# EAGLE design Adapter-IO4-Molex156 (EAGLE 7.7.0)
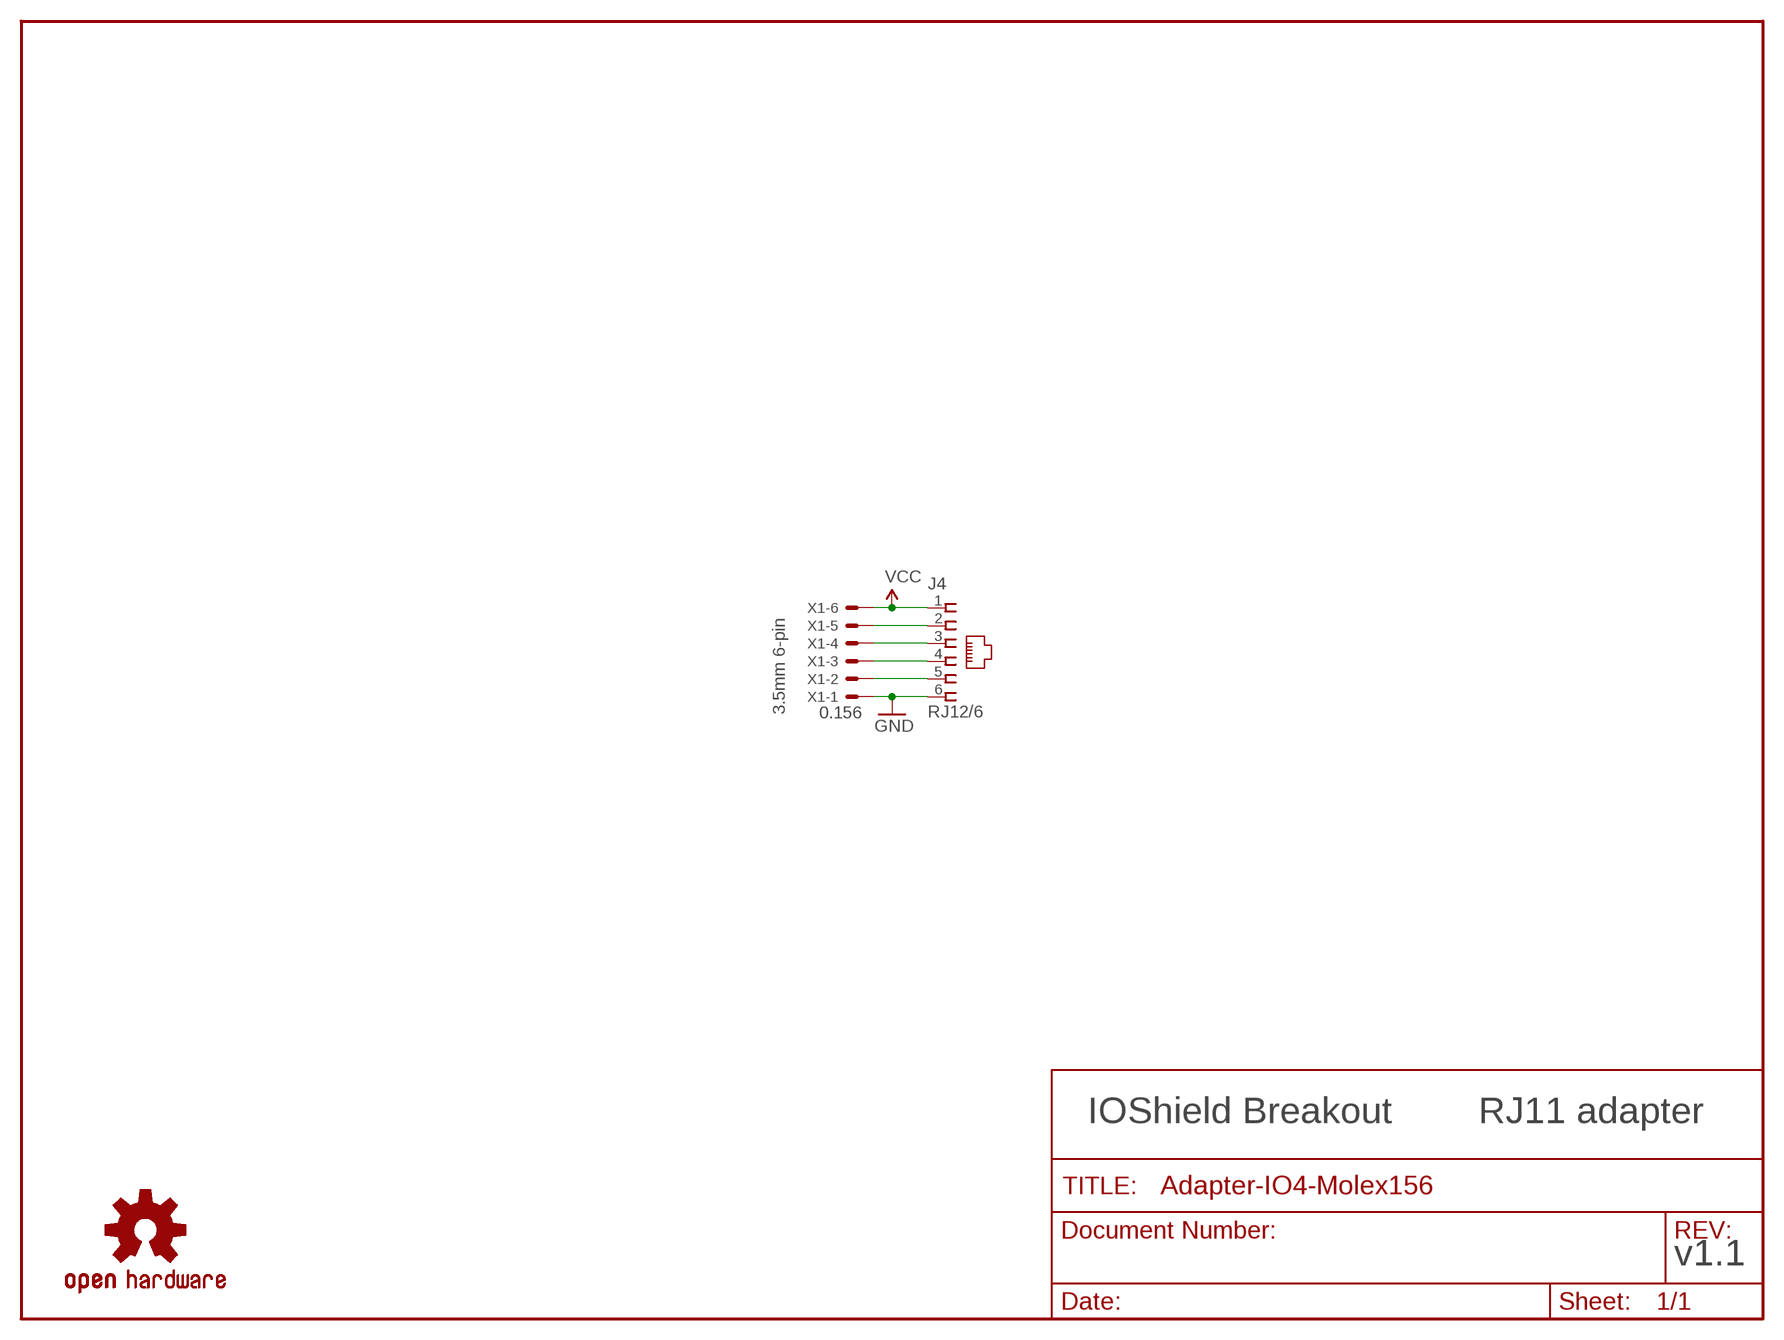
[diagram p0: schematic, sheet 1]

## Parts
J4  RJ12/6  CONNECTOR-RJ25-6P6C  [RJ25-PANEL]
U$1  OSHW  DOC-OSHW-LOGO-M  [OSHW-LOGO-M]
X1  0.156  KK-156-6  [KK-156-6]

## Nets
GND: J4.6 X1.1
IO1: J4.2 X1.5
IO2: J4.3 X1.4
IO3: J4.4 X1.3
IO4: J4.5 X1.2
VCC: J4.1 X1.6

## Notes on the sheet
- 3.5mm 6-pin
- IOShield Breakout | RJ11 adapter
- v1.1

## Library data of the parts
J4 = SPCoast:CONNECTOR-RJ25: AMP connector; AMP: 520250-3; OPL: none
U$1 = SPCoast:DOC-OSHW-LOGO-: Open Source Hardware Logo This logo indicates the piece of hardware it is found on incorporates a OSHW license and/or adheres to the definition of open source hardware http://freedomdefined.org/OSHW Creative Commons - Attribution - ShareAlike 3.0
X1 = SPCoast:KK-156-6: KK 156 HEADER Source: http://www.molex.com/pdm_docs/sd/026604100_sd.pdf; OC_FARNELL: unknown; OC_NEWARK: unknown

## Net classes
0 default: width 0.508 mm

## Board
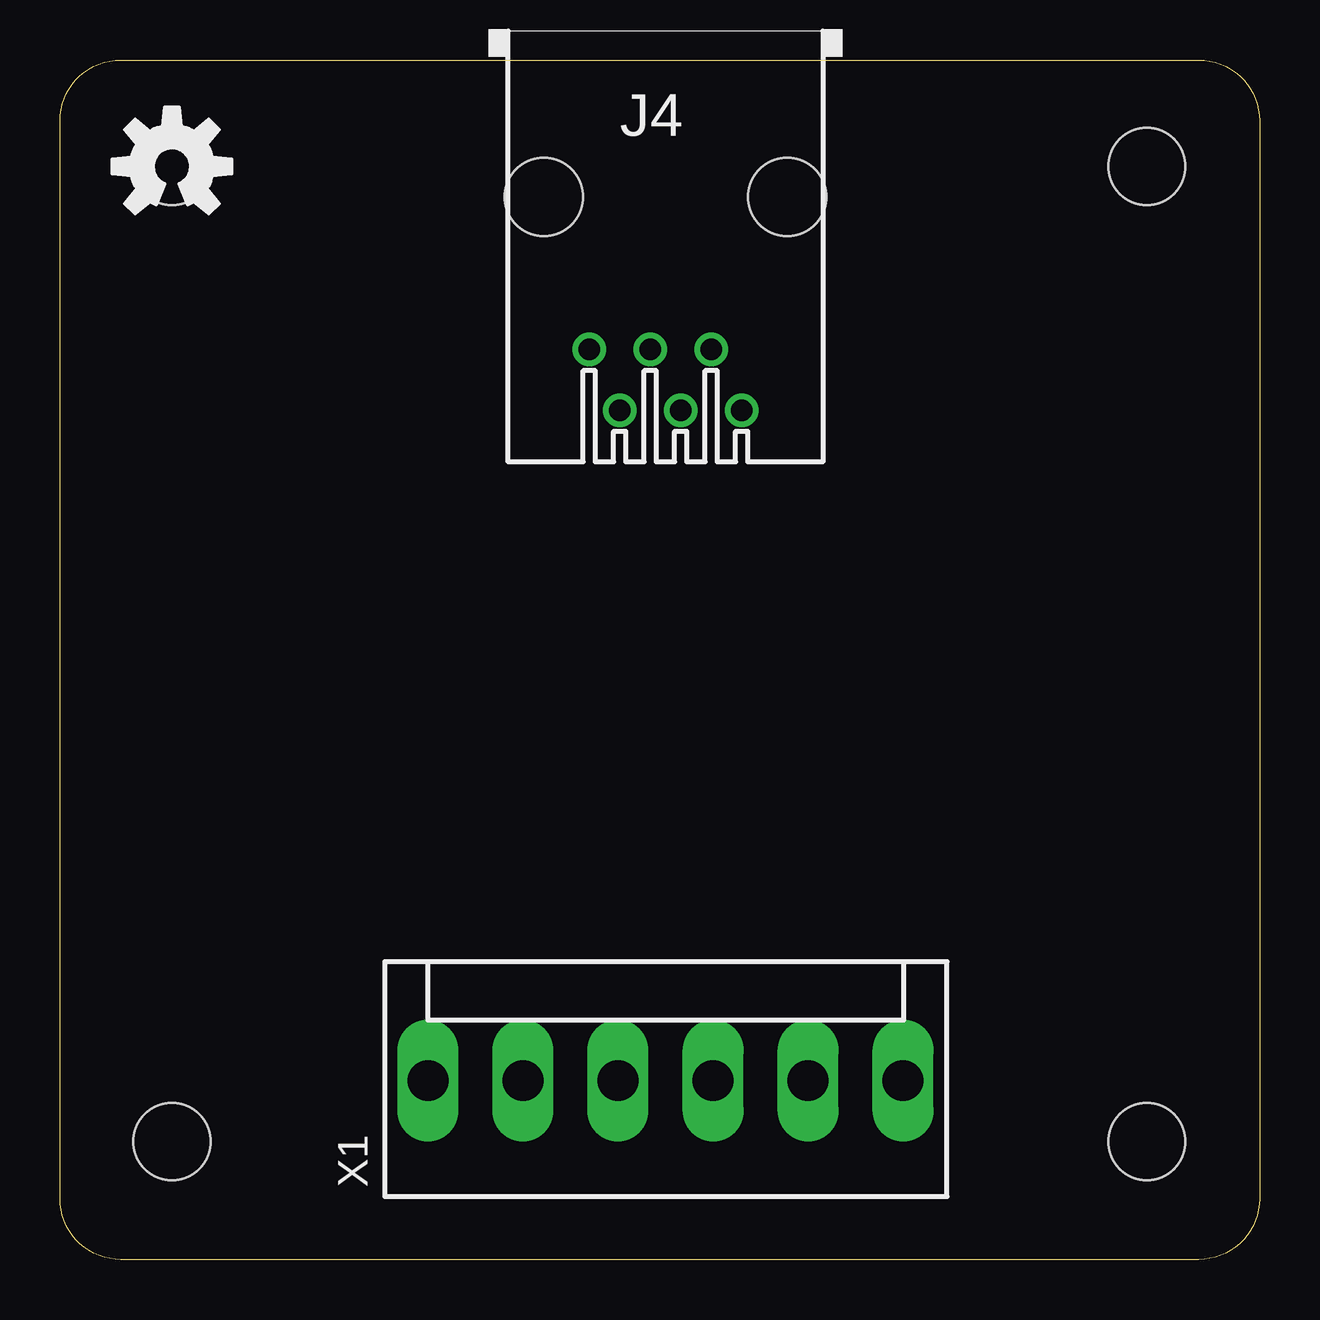
[diagram p1: board, top side]
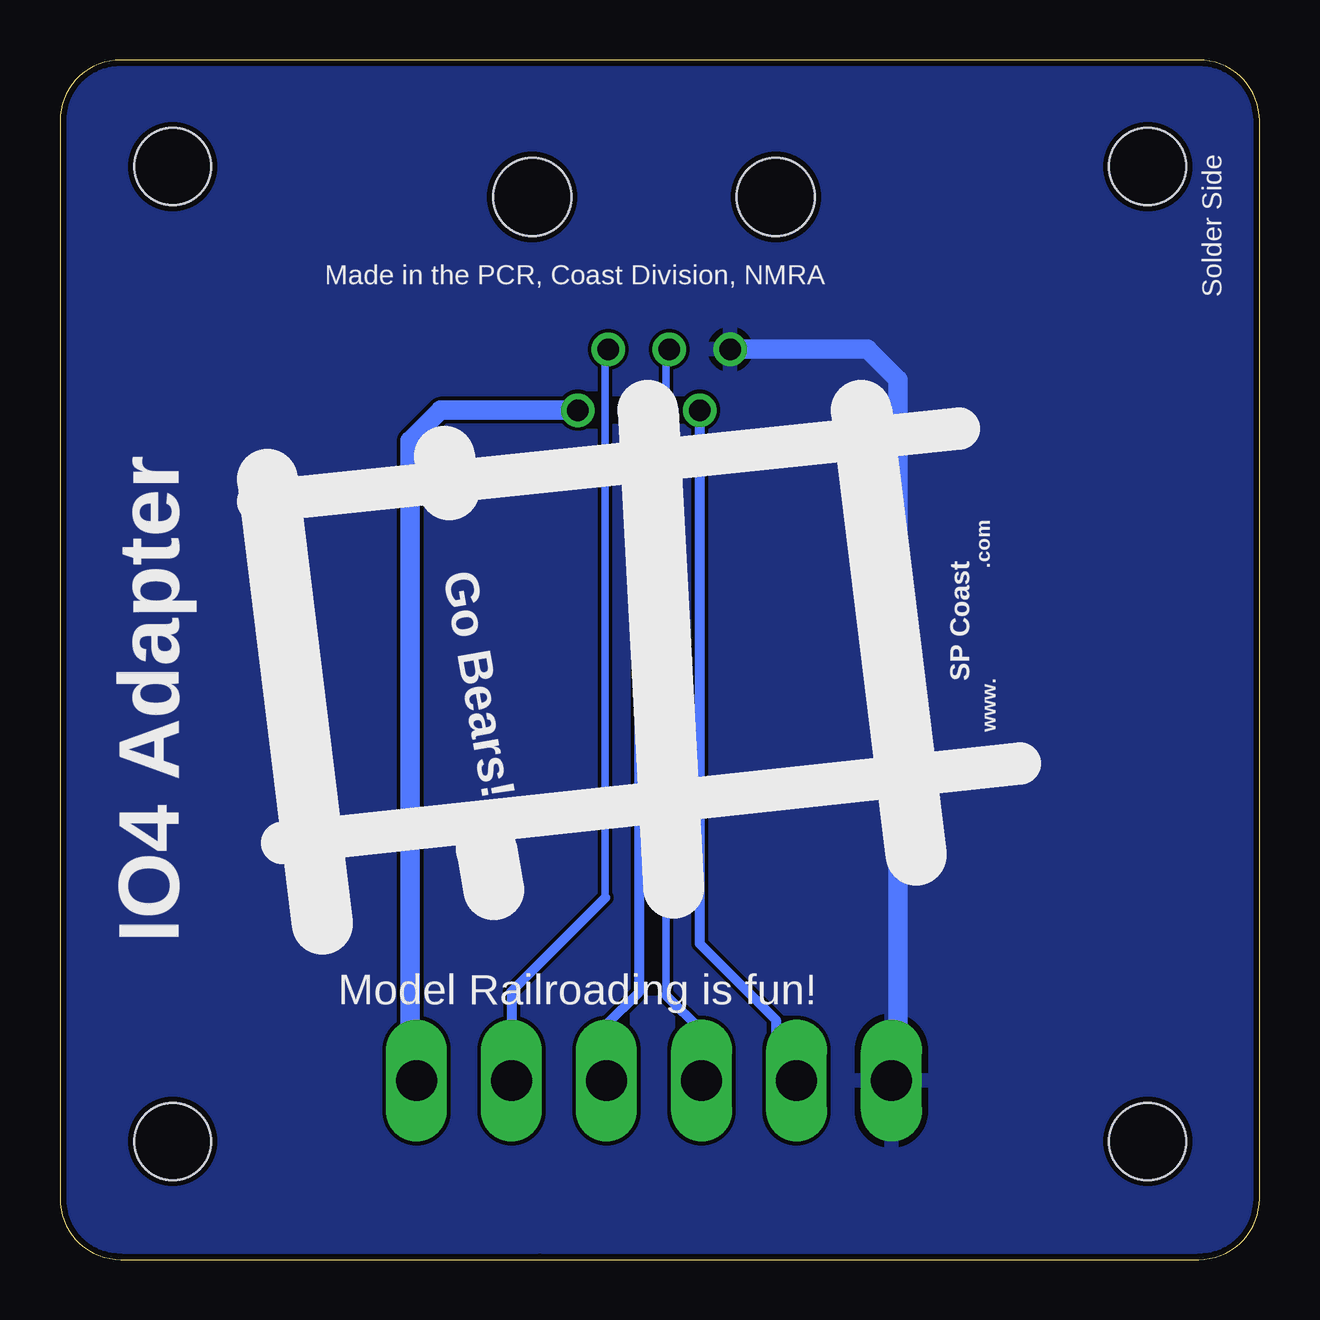
[diagram p2: board, bottom side, seen from below]

Size 50 x 50 mm. Coordinates in mm from the lower left corner, seen from the top.
Outline: 0,10 0,47.46 arc-90 2.54,50 20,50 47.46,50 arc-90 50,47.46 50,30 50,2.54 arc-90 47.46,0 30,0 2.54,0 arc-90 0,2.54 0,10
Copper layers (1*16): Top 0.035mm / dielectric 1.5mm / Bottom 0.035mm
Design rules "Fusion_eagle_rule_v1.1": minimum track width 6mil, minimum drill 12mil, track to track 6mil, track to pad 6mil, pad to pad 6mil, via to via 6mil, smd to smd 0mil, copper to edge 10mil, drill to drill 10mil, minimum pad ring 10mil, minimum via ring 6mil, stop-mask expansion 2mil, vias tented up to drill 100mil, thermal gap 10mil
Holes 3.2 mm at 45.31,45.56 4.67,45.56 4.67,4.92 45.31,4.92

### Footprints (pad centres in the part's own frame; a part is rotated, then mirrored left to right if it is on the bottom)
RJ25-PANEL = drill 0.889: 1 -3.175,8.89; 2 -1.905,6.35; 3 -0.635,8.89; 4 0.635,6.35; 5 1.905,8.89; 6 3.175,6.35 | hole 3.251: -5.08,0; 5.08,0
KK-156-6 = drill 1.7 pad 2.184 long: 1 -9.9,0; 2 -5.94,0; 3 -1.98,0; 4 1.98,0; 5 5.94,0; 6 9.9,0

### Placement (x,y rotation side)
J4  25.24,44.29 180 top
U$1  4.67,45.56 0 top
X1  25.24,7.46 0 top

### Tracks (layer width: path | path; a pad name or v marks a point on that pad's centre or on a via)
GND
  Bottom 0.813: J4.6 16.35,37.94 15.08,36.67 15.08,7.72 X1.1
  pour Bottom: -0.62,49.75 49.86,49.75 49.86,-0.36 -0.62,-0.36
IO1
  Bottom 0.305: J4.2 27.27,37.81 27.27,15.08
  Bottom 0.406: 27.27,15.08 31.18,11.17 X1.5
IO2
  Bottom 0.305: 27.27,9.75 27.27,7.51 X1.4
  Bottom 0.406: J4.3 25.88,11.14 27.27,9.75
IO3  (via drill 0.6)
  Top 0.305: v24.62,37.94 v24.73,37.94
  Bottom 0.305: J4.4 v24.62,37.94 | v24.73,37.94 24.73,11.02
  Bottom 0.406: J4.4 v24.62,37.94 | 24.73,11.02 23.26,9.54 X1.3
IO4
  Bottom 0.406: J4.5 23.34,13.18 20.16,10 20.16,8.32 X1.2
VCC
  Bottom 0.813: J4.1 34.13,35.4 35.4,34.13 35.4,7.72 X1.6

### Text on the board
bNames: Solder Side | Made in the PCR, Coast Division, NMRA | IO4 Adapter | .com | SP Coast | www. | Go Bears! | Model Railroading is fun!
Document: John | Plocher | Open Source | 2014.02 | Hardware | IO4-Breakout | v1.1 | 0.156 Pitch | Gnd
tDocu: 4 | 3 | 2 | 1 | V+ | 0.156 pitch